# EAGLE design PEM-Adapter_1.0.0 (EAGLE 9.2.1)
COMPANY: DvidMakesThings; REVISION: 1.0.0; WEB: https://github.com/DvidMakesThings/HW_10-In-Rack_PDU
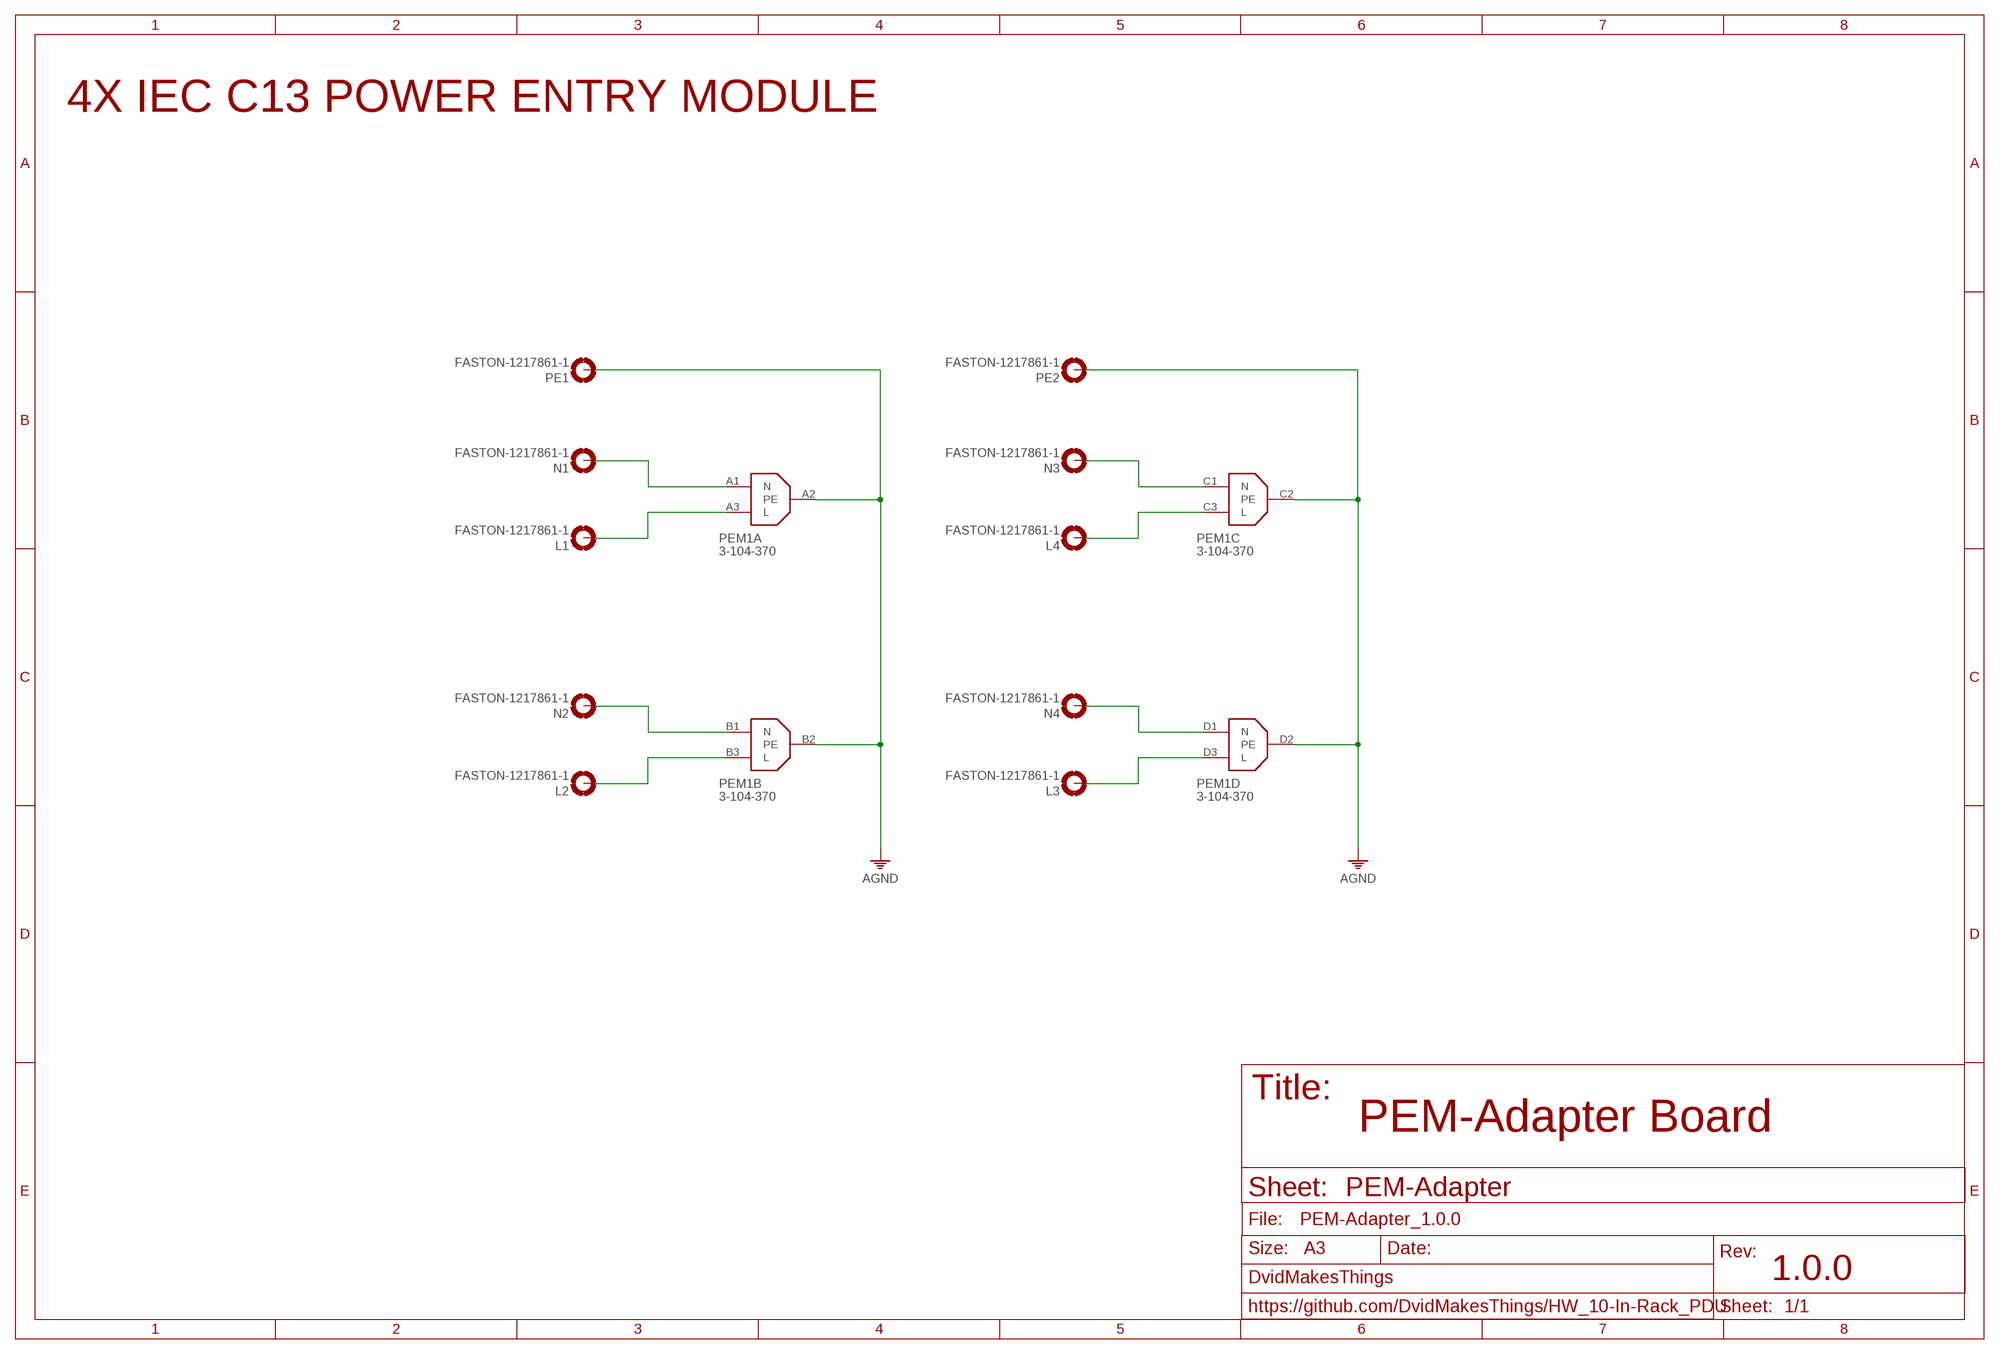
[diagram p0: schematic, sheet 1]

## Parts
L1  FASTON-1217861-1  [1217861-1]
L2  FASTON-1217861-1  [1217861-1]
L3  FASTON-1217861-1  [1217861-1]
L4  FASTON-1217861-1  [1217861-1]
N1  FASTON-1217861-1  [1217861-1]
N2  FASTON-1217861-1  [1217861-1]
N3  FASTON-1217861-1  [1217861-1]
N4  FASTON-1217861-1  [1217861-1]
PE1  FASTON-1217861-1  [1217861-1]
PE2  FASTON-1217861-1  [1217861-1]
PEM1  3-104-370  [3-104-370]

## Nets
AGND: PE1.1(MOUNT) PE1.2(MOUNT) PE2.1(MOUNT) PE2.2(MOUNT) PEM1.A2(A:PE) PEM1.B2(B:PE) PEM1.C2(C:PE) PEM1.D2(D:PE)
L1: L1.1(MOUNT) L1.2(MOUNT) PEM1.A3(A:L)
L2: L2.1(MOUNT) L2.2(MOUNT) PEM1.B3(B:L)
L3: L4.1(MOUNT) L4.2(MOUNT) PEM1.C3(C:L)
L4: L3.1(MOUNT) L3.2(MOUNT) PEM1.D3(D:L)
N1: N1.1(MOUNT) N1.2(MOUNT) PEM1.A1(A:N)
N2: N2.1(MOUNT) N2.2(MOUNT) PEM1.B1(B:N)
N3: N3.1(MOUNT) N3.2(MOUNT) PEM1.C1(C:N)
N4: N4.1(MOUNT) N4.2(MOUNT) PEM1.D1(D:N)

## Notes on the sheet
- 4X IEC C13 POWER ENTRY MODULE
- PEM-Adapter Board
- PEM-Adapter

## Library data of the parts
L1-L4 N1-N4 PE1 PE2 = ds_con:FASTON-1217861-1; DATASHEET: https://www.farnell.com/cad/1922572.pdf; DESCRIPTION: Brass Tin Plugin SMD Quick Terminal ROHS; LCSC_PART: C428480; MANUFACTURER: TE CONNECTIVITY; MPN: 1217861-1; ROHS: YES
PEM1 = ds_con:3-104-370; DESCRIPTION: Power Entry Connector Receptacle, Female Sockets Panel Mount, Snap-In; MANUFACTURER: SCHURTER Inc.; MPN: 3-104-370; ROHS: YES

## Board
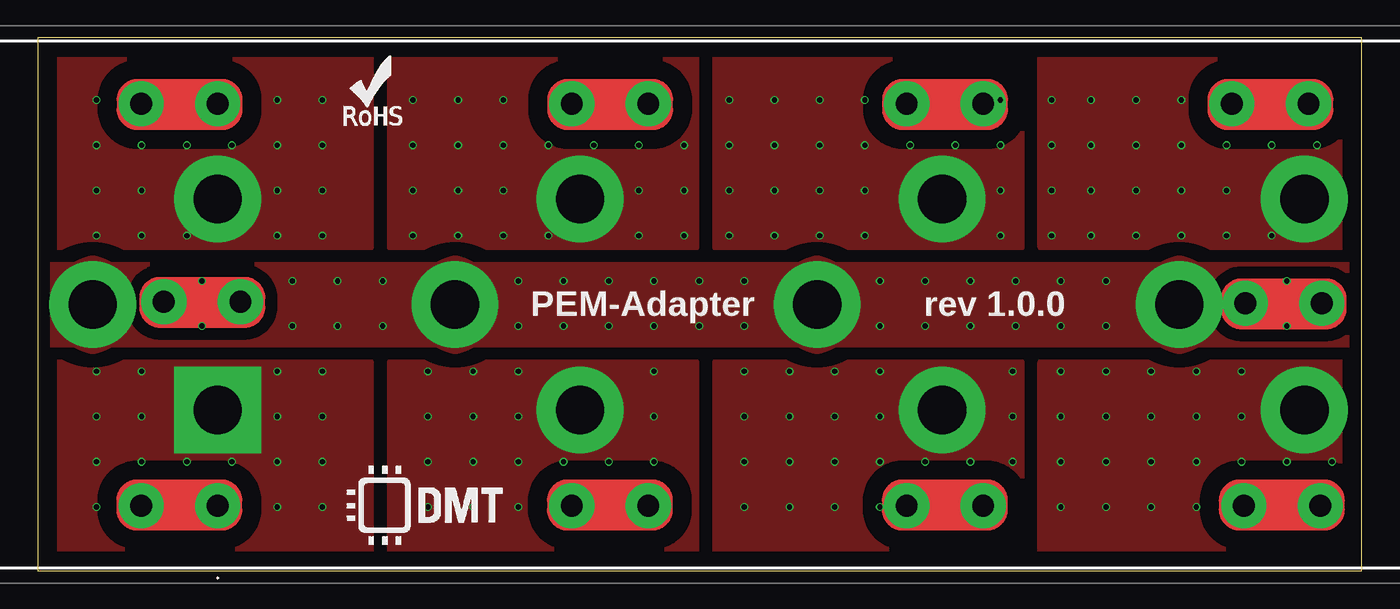
[diagram p1: board, top side]
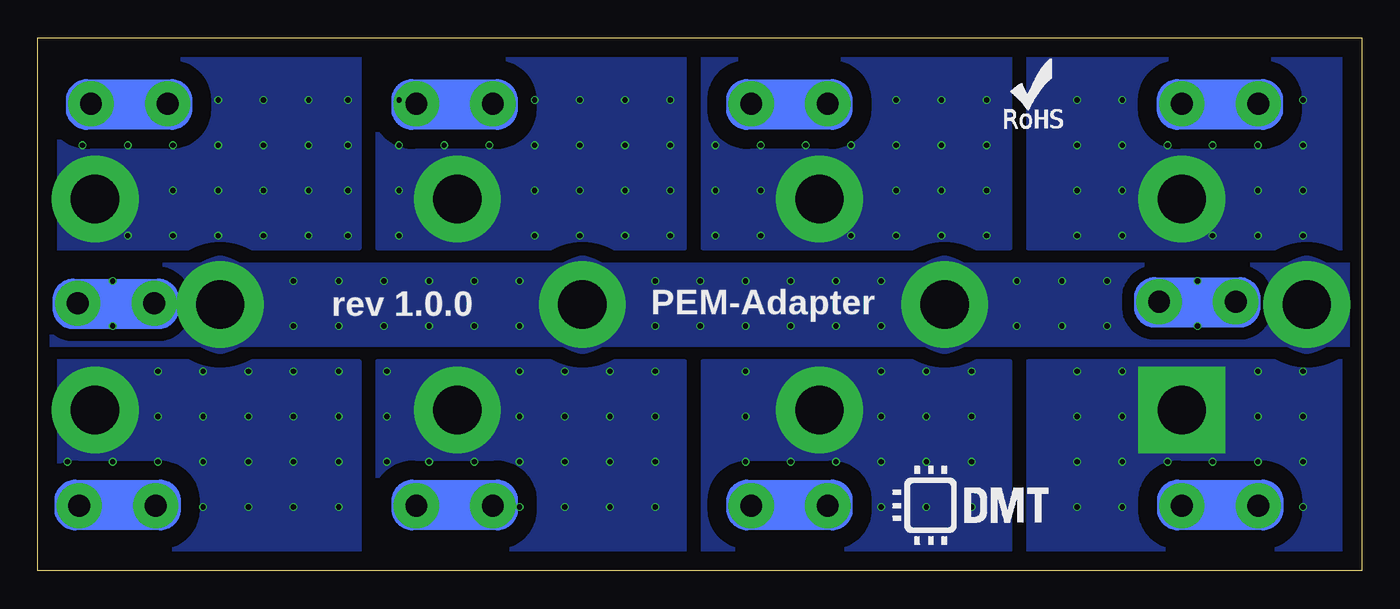
[diagram p2: board, bottom side, seen from below]

Size 87.88 x 35.37 mm. Coordinates in mm from the lower left corner, seen from the top.
Outline: 0,0 87.88,0 87.88,35.37 0,35.37 0,0
Copper layers (1*16): Top 0.035mm / dielectric 1.6mm / Bottom 0.035mm
Design rules "jlcpcb-2layers": minimum track width 5mil, minimum drill 0.3mm, track to track 5mil, track to pad 5mil, pad to pad 5mil, via to via 5mil, smd to smd 5mil, copper to edge 0.2mm, drill to drill 6mil, minimum pad ring 10mil, minimum via ring 3mil, stop-mask expansion 4mil, vias tented up to drill 0mil, thermal gap 10mil

### Footprints (pad centres in the part's own frame; a part is rotated, then mirrored left to right if it is on the bottom)
1217861-1 = drill 1.45 pad 3: 1 0,0; 2 5.08,0
3-104-370 = drill 3.2 pad 4.5 square: A1 -31.75,-7.62 | drill 3.2 pad 4.5: A2 -40.05,-0.62; A3 -31.75,6.38; B1 -7.71,-7.62; B2 -16.01,-0.62; B3 -7.71,6.38; C1 16.33,-7.62; C2 8.03,-0.62; C3 16.33,6.38; D1 40.37,-7.62; D2 32.07,-0.62; D3 40.37,6.38

### Placement (x,y rotation side)
L1  6.87,30.98 180 bottom
L2  35.45,30.98 180 bottom
L3  79.26,30.98 180 bottom
L4  57.67,30.98 180 bottom
N1  11.95,4.32 0 bottom
N2  40.52,4.32 0 bottom
N3  62.75,4.32 0 bottom
N4  85.12,4.32 0 bottom
PE1  8.38,17.86 180 bottom
PE2  80.15,17.76 180 bottom
PEM1  43.7,18.29 0 top
U$1  DNI  [DMT]  22.98,4.32 0 top
U$2  DNI  [DMT]  28.66,4.32 0 bottom
U$3  DNI  [ROHS_LOGO_0.18_IN]  20.11,29.45 0 top
U$4  DNI  [ROHS_LOGO_0.18_IN]  23.92,29.25 0 bottom

### Tracks (layer width: path | path; a pad name or v marks a point on that pad's centre or on a via)
AGND  (via drill 0.35)
  other vias: 10.9,16.23 10.9,19.23 16.9,16.23 16.9,19.23 19.9,19.23 19.9,16.23 22.9,16.23 22.9,19.23 31.9,19.23 31.9,16.23 34.9,16.23 37.9,16.23 40.9,16.23 43.9,16.23 46.9,16.23 55.9,16.23 58.9,16.23 61.9,16.23 64.9,16.23 67.9,16.23 70.9,16.23 82.9,16.23 82.9,19.23 70.9,19.23 67.9,19.23 64.9,19.23 61.9,19.23 58.9,19.23 55.9,19.23 46.9,19.23 43.9,19.23 40.9,19.23 37.9,19.23 34.9,19.23
  pour Top (isolate 0.8, rank 2, no thermals): -0.01,20.82 88.28,20.82 88.28,14.47 -0.01,14.47
  pour Bottom (isolate 0.8, rank 2, no thermals): -0.01,20.82 88.28,20.82 88.28,14.47 -0.01,14.47
L1  (via drill 0.35)
  other vias: 3.9,22.23 6.9,22.23 9.9,22.23 15.9,22.23 15.9,25.23 15.9,28.23 12.9,28.23 9.9,28.23 6.9,28.23 3.9,28.23 3.9,31.23 3.9,25.23 6.9,25.23 15.9,31.23 18.9,31.23 18.9,28.23 18.9,25.23 18.9,22.23
  pour Top (isolate 1.27, no thermals): -0.01,36.43 22.11,36.43 22.11,21.46 -0.01,21.46
  pour Bottom (isolate 1.27, no thermals): -0.01,36.43 22.11,36.43 22.11,21.46 -0.01,21.46
L2  (via drill 0.35)
  other vias: 24.9,22.23 27.9,22.23 30.9,22.23 33.9,22.23 39.9,22.23 39.9,25.23 39.9,28.23 24.9,31.23 27.9,31.23 27.9,28.23 24.9,28.23 24.9,25.23 27.9,25.23 30.9,25.23 30.9,28.23 33.9,28.23 36.9,28.23 30.9,31.23 42.9,22.23 42.9,25.23 42.9,28.23
  pour Top (isolate 1.27, no thermals): 23.38,36.43 43.7,36.43 43.7,21.46 23.38,21.46
  pour Bottom (isolate 1.27, no thermals): 23.38,36.43 43.7,36.43 43.7,21.46 23.38,21.46
L3  (via drill 0.35)
  other vias: 45.9,22.23 48.9,22.23 51.9,22.23 54.9,22.23 54.9,25.23 51.9,25.23 48.9,25.23 45.9,25.23 45.9,28.23 45.9,31.23 48.9,31.23 51.9,31.23 51.9,28.23 48.9,28.23 54.9,28.23 57.9,28.23 60.9,28.23 63.9,28.23 63.9,31.23 63.9,25.23 63.9,22.23 54.9,31.23
  pour Top (isolate 1.27, no thermals): 44.97,36.43 65.29,36.43 65.29,21.46 44.97,21.46
  pour Bottom (isolate 1.27, no thermals): 44.97,36.43 65.29,36.43 65.29,21.46 44.97,21.46
L4  (via drill 0.35)
  other vias: 84.9,28.23 81.9,28.23 78.9,28.23 75.9,28.23 72.9,28.23 69.9,28.23 67.3,28.23 67.3,31.23 67.3,25.23 67.3,22.23 69.9,22.23 72.9,22.23 75.9,22.23 78.9,22.23 81.9,22.23 78.9,25.23 75.9,25.23 72.9,25.23 69.9,25.23 69.9,31.23 72.9,31.23 75.9,31.23
  pour Top (isolate 1.27, no thermals): 66.56,36.43 88.28,36.43 88.28,21.46 66.56,21.46
  pour Bottom (isolate 1.27, no thermals): 66.56,36.43 88.28,36.43 88.28,21.46 66.56,21.46
N1  (via drill 0.35)
  other vias: 3.9,10.23 6.9,10.23 6.9,7.24 3.9,7.24 3.9,4.24 9.9,7.24 12.9,7.24 15.9,7.24 18.9,7.24 15.9,10.23 18.9,10.23 3.9,13.23 6.9,13.23 15.9,13.23 18.9,13.23 15.9,4.24 18.9,4.24
  pour Top (isolate 1.27, no thermals): -0.01,13.84 22.11,13.84 22.11,-1.33 -0.01,-1.33
  pour Bottom (isolate 1.27, no thermals): -0.01,13.84 22.11,13.84 22.11,-1.33 -0.01,-1.33
N2  (via drill 0.35)
  other vias: 25.9,13.23 28.9,13.23 31.9,13.23 40.9,13.23 40.9,10.23 40.9,7.24 25.9,4.24 25.9,7.24 25.9,10.23 28.9,10.23 28.9,7.24 28.9,4.24 31.9,4.24 31.9,7.24 31.9,10.23 34.9,7.24 37.9,7.24
  pour Top (isolate 1.27, no thermals): 23.38,13.84 43.7,13.84 43.7,-1.33 23.38,-1.33
  pour Bottom (isolate 1.27, no thermals): 23.38,13.84 43.7,13.84 43.7,-1.33 23.38,-1.33
N3  (via drill 0.35)
  other vias: 46.9,4.24 46.9,7.24 46.9,10.23 46.9,13.23 49.9,13.23 49.9,10.23 49.9,7.24 49.9,4.24 52.9,4.24 52.9,7.24 52.9,10.23 52.9,13.23 55.9,13.23 55.9,10.23 55.9,7.24 55.9,4.24 64.7,7.24 61.9,7.24 58.9,7.24 64.7,13.23 64.7,10.23
  pour Top (isolate 1.27, no thermals): 44.97,13.84 65.29,13.84 65.29,-1.33 44.97,-1.33
  pour Bottom (isolate 1.27, no thermals): 44.97,13.84 65.29,13.84 65.29,-1.33 44.97,-1.33
N4  (via drill 0.35)
  other vias: 70.9,4.24 70.9,7.24 70.9,10.23 70.9,13.23 73.9,13.23 73.9,10.23 73.9,7.24 73.9,4.24 76.9,4.24 76.9,7.24 76.9,10.23 76.9,13.23 79.9,13.23 79.9,10.23 79.9,7.24 85.9,7.24 82.9,7.24 67.9,13.23 67.9,10.23 67.9,7.24 67.9,4.24
  pour Top (isolate 1.27, no thermals): 66.56,13.84 88.28,13.84 88.28,-1.33 66.56,-1.33
  pour Bottom (isolate 1.27, no thermals): 66.56,13.84 88.28,13.84 88.28,-1.33 66.56,-1.33

### Text on the board
tNames: PEM-Adapter | rev 1.0.0
bNames: PEM-Adapter | rev 1.0.0